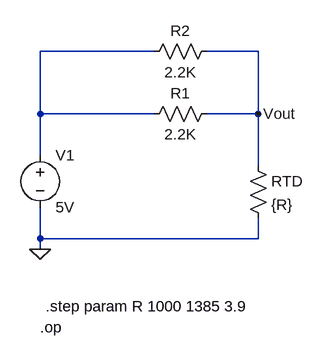
[diagram p0: schematic rtd_jm_sim_base_rtd_Voltage_Divider.asc]
rtd_jm_sim_base_rtd_Voltage_Divider.asc, the LTspice schematic file:
Version 4
SHEET 1 880 680
WIRE 400 0 224 0
WIRE 560 0 480 0
WIRE 224 96 224 0
WIRE 400 96 224 96
WIRE 560 96 560 0
WIRE 560 96 480 96
WIRE 224 160 224 96
WIRE 560 176 560 96
WIRE 224 288 224 240
WIRE 560 288 560 256
WIRE 560 288 224 288
WIRE 224 304 224 288
FLAG 224 304 0
FLAG 560 96 Vout
SYMBOL voltage 224 144 R0
WINDOW 123 0 0 Left 0
WINDOW 39 0 0 Left 0
SYMATTR InstName V1
SYMATTR Value 5V
SYMBOL res 496 80 R90
WINDOW 0 0 56 VBottom 2
WINDOW 3 32 56 VTop 2
SYMATTR InstName R1
SYMATTR Value 2.2K
SYMBOL res 544 160 R0
SYMATTR InstName RTD
SYMATTR Value {R}
SYMBOL res 496 -16 R90
WINDOW 0 0 56 VBottom 2
WINDOW 3 32 56 VTop 2
SYMATTR InstName R2
SYMATTR Value 2.2K
TEXT 224 424 Left 2 !.op
TEXT 232 392 Left 2 !.step param R 1000 1385 3.9

The netlist it stands for:
* rtd_jm_sim_base_rtd_Voltage_Divider.asc
V1 N001 0 5V
R1 Vout N001 2.2K
RTD Vout 0 {R}
R2 Vout N001 2.2K
.op
.step param R 1000 1385 3.9
.backanno
.end